# Altium schematic sheet Temperature_Controller_1.SchDoc
size A4; SheetNumber: 1; SheetTotal: 1
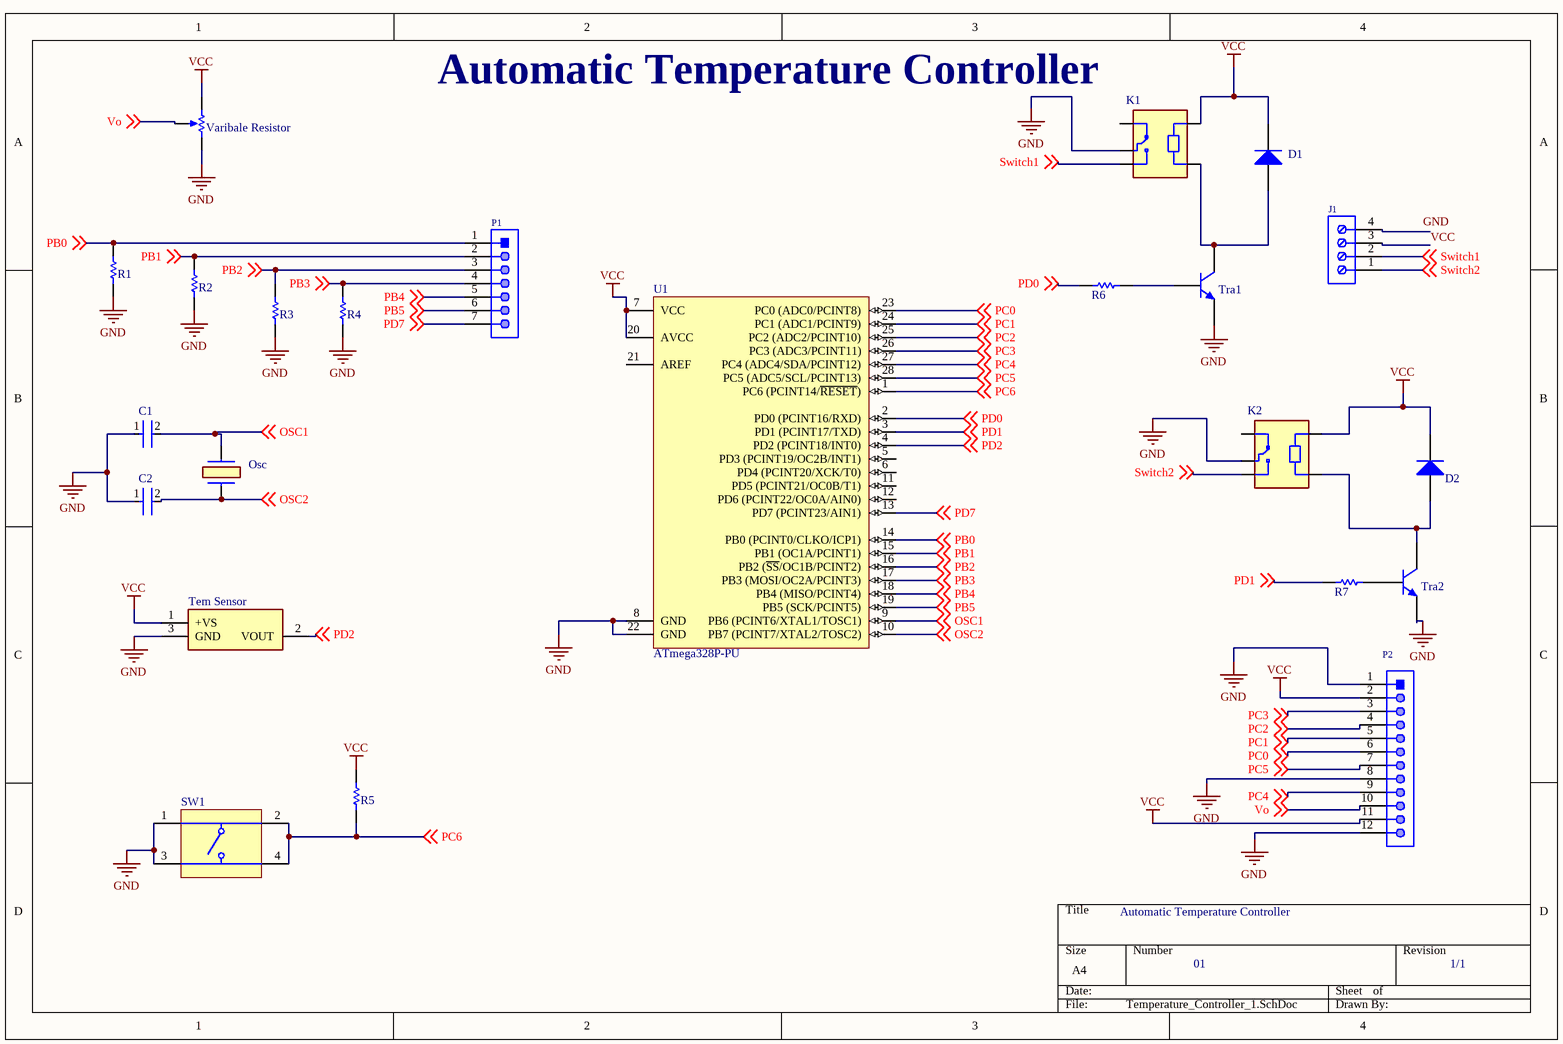
[diagram p0: Temperature_Controller_1.SchDoc]

## Parts
(Parts that share a designator on the sheet are numbered #1, #2 ... from top to bottom, then left to right.)
?#1  Tra1  [TO-226-AA]
?#2  J1  [691244510004]
C1  (no value)  [FP-RCE0K1-MFG]
C2  (no value)  [FP-RCE0K1-MFG]
D1  D1  [DO-41]
D2  D2  [DO-41]
K1  K1  [RELAY_SRD-05VDC-SL-C]
K2  K2  [RELAY_SRD-05VDC-SL-C]
Osc  (no value)  [ECS80204X]
P1  P1  [61300711121]
P3  P2  [61301211021]
R1  R1  [AXIAL-0.3]
R2  R2  [AXIAL-0.3]
R3  R3  [AXIAL-0.3]
R4  R4  [AXIAL-0.3]
R5  R5  [AXIAL-0.3]
R6  R6  [AXIAL-0.3]
R7  R7  [AXIAL-0.3]
SW1  SW1  [TECO-1825910-6_V]
Tem_Sensor  (no value)  [TL431CLP]
Tra2  Tra2  [TO-226-AA]
U1  ATmega328P-PU  [28P3]
Var_Resis?  Varibale Resistor  [VR5]

## Nets
GND: ?#1.3(E) C1.1 C2.1 K1.COM K2.COM P3.1 P3.8 P3.12 R1.1 R2.1 R3.1 R4.1 SW1.1 SW1.3 Tem_Sensor.3(GND) Tra2.3(E) U1.8(GND) U1.22(GND) Var_Resis?.2(BOT)
VCC: ?#2.3 D1.2(K) D2.2(K) K1.A2 K2.A2 P3.2 P3.11 R5.2 Tem_Sensor.1(+VS) U1.7(VCC) U1.20(AVCC) Var_Resis?.1(TOP)
OSC1: C1.2 Osc.2 U1.9(PB6_(PCINT6/XTAL1/TOSC1)) ; off-sheet OSC1
OSC2: C2.2 Osc.1 U1.10(PB7_(PCINT7/XTAL2/TOSC2)) ; off-sheet OSC2
PB0: P1.1 R1.2 U1.14(PB0_(PCINT0/CLKO/ICP1)) ; off-sheet PB0
PB1: P1.2 R2.2 U1.15(PB1_(OC1A/PCINT1)) ; off-sheet PB1
PB2: P1.3 R3.2 U1.16(PB2_(~{SS}/OC1B/PCINT2)) ; off-sheet PB2
PB3: P1.4 R4.2 U1.17(PB3_(MOSI/OC2A/PCINT3)) ; off-sheet PB3
PB4: P1.5 U1.18(PB4_(MISO/PCINT4)) ; off-sheet PB4
PB5: P1.6 U1.19(PB5_(SCK/PCINT5)) ; off-sheet PB5
PC0: P3.6 U1.23(PC0_(ADC0/PCINT8)) ; off-sheet PC0
PC1: P3.5 U1.24(PC1_(ADC1/PCINT9)) ; off-sheet PC1
PC2: P3.4 U1.25(PC2_(ADC2/PCINT10)) ; off-sheet PC2
PC3: P3.3 U1.26(PC3_(ADC3/PCINT11)) ; off-sheet PC3
PC4: P3.9 U1.27(PC4_(ADC4/SDA/PCINT12)) ; off-sheet PC4
PC5: P3.7 U1.28(PC5_(ADC5/SCL/PCINT13)) ; off-sheet PC5
PC6: R5.1 SW1.2 SW1.4 U1.1(PC6_(PCINT14/~{RESET})) ; off-sheet PC6
PD0: R6.2 U1.2(PD0_(PCINT16/RXD)) ; off-sheet PD0
PD1: R7.2 U1.3(PD1_(PCINT17/TXD)) ; off-sheet PD1
PD2: Tem_Sensor.2(VOUT) U1.4(PD2_(PCINT18/INT0)) ; off-sheet PD2
PD7: P1.7 U1.13(PD7_(PCINT23/AIN1)) ; off-sheet PD7
Switch1: ?#2.2 K1.NO ; off-sheet Switch1
Switch2: ?#2.1 K2.NO ; off-sheet Switch2
Vo: P3.10 Var_Resis?.3(TAP) ; off-sheet Vo
Net?#1_1: ?#1.1(C) D1.1(A) K1.A1
Net?#1_2: ?#1.2(B) R6.1
NetD2_1: D2.1(A) K2.A1 Tra2.1(C)
NetR7_1: R7.1 Tra2.2(B)

Not connected (* = marked no-connect by the designer): ?#2 4; K1 NC; K2 NC; U1 5(PD3_(PCINT19/OC2B/INT1)) 6(PD4_(PCINT20/XCK/T0)) 11(PD5_(PCINT21/OC0B/T1)) 12(PD6_(PCINT22/OC0A/AIN0)) 21(AREF)

## Notes on the sheet
- (near K1) Automatic Temperature Controller
- Automatic Temperature Controller
- 01
- 1/1
- Labels drawn without touching a wire or pin: GND

## Library data of the parts
?#1 Tra2 = NPN: NPN Bipolar Transistor; Published: 8-Jun-2000; LatestRevisionDate: 17-Jul-2002; LatestRevisionNote: Re-released for DXP Platform.; PackageReference: TO-226-AA; Publisher: Altium Limited; PackageDescription: TO, Flat Index; 3 In-Line, Axial Leads; Body Dia. 4.8mm; Leads 0.55 x 0.51 mm (max); Code_JEDEC: TO-226-AA
?#2 = CMP-1502-02650-1: Serie 2445 - 5.08 mm Horizontal Entry Modular with Rising Cage Clamp WR-TBL, 4 pin; Manufacturer: Wurth Elektronik; Pitch: 5.08mm; Pin Number: 4; Operating Temperature: -30to120degC; Publisher: WurthElektronik; Datasheet URL: http://katalog.we-online.de/em/datasheet/6912445100xx.pdf; Packaging: Box; Package Reference: 691244510004; Part Number: 691244510004; Mounting Technology: THT; Manufacturer URL: http://www.we-online.de
C1 C2 = CMP-06035-004895-1: Cap Ceramic 22pF 50V C0G ±5% Radial 5mm +125°C Automotive Bulk; Lead/Base Style: Formed Leads; Lead Diameter: 0.5mm; Max Operating Temperature: 125°C; Termination: Radial; Package Quantity: 2000; Capacitance: 22pF; Dielectric: C0G; Height - Seated (Max): 0.138inch; Width: 0.098inch; Lead Pitch: 0.197inch; Tolerance: 5%; Resistor Type: Ceramic; Case/Package: Radial; Mount: Through Hole; Voltage Rating: 50V; Ratings: AEC-Q200; Min Operating Temperature: -55°C; Packaging: Tape and Reel; Voltage Rating (DC): 50V; Height: 3.5mm; Length: 0.142inch
D1 D2 = Diode 1N4004: 1 Amp General Purpose Rectifier; Published: 8-Jun-2000; LatestRevisionDate: 17-Jul-2002; LatestRevisionNote: Re-released for DXP Platform.; DatasheetVersion: 1998; PackageVersion: Aug-1999; PackageReference: DO-41; Publisher: Altium Limited; PackageDescription: Diode, Axial; Body 5.2 x 2.7 mm (LxDia. max), Lead Dia. 0.86 mm (max); Code_JEDEC: DO-204-AL; ComponentLink1Description: Manufacturer Link; ComponentLink1URL: http://www.fairchildsemi.com/; ComponentLink2Description: Datasheet; ComponentLink2URL: http://www.fairchildsemi.com/ds/1N%2F1N4001.pdf
K1 K2 = SRD-05VDC-SL-C: 5V Trigger Relay Module For Arduino And Raspberry Pi 5V Trigger Relay Module For Arduino And Raspberry Pi; MF: Songle Relay; Check_prices: https://www.snapeda.com/parts/SRD-05VDC-SL-C/Songle+Relay/view-part/?ref=eda; Value: *; Availability: Not in stock; Price: None; Package: NON STANDARD-5 Songle Relay; MP: SRD-05VDC-SL-C; SnapEDA_Link: https://www.snapeda.com/parts/SRD-05VDC-SL-C/Songle+Relay/view-part/?ref=snap
Osc = ECS-80-20-4X: Crystals 8MHz 20pF; Manufacturer_Name: ECS; Geometry.Height: 3.5mm; Mouser Part Number: 520-HCU800-20X; Mouser Price/Stock: https://www.mouser.co.uk/ProductDetail/ECS/ECS-80-20-4X?qs=Plv2eWRe7VJH6hqFYPCsSw%3D%3D; Manufacturer_Part_Number: ECS-80-20-4X; Datasheet Link: https://componentsearchengine.com/Datasheets/1/ECS-80-20-4X.pdf
P1 = CMP-1502-01074-1: THT Vertical Pin Header WR-PHD, Pitch 2.54 mm, Single Row, 7 pins; Manufacturer: Wurth Elektronik; Pin Number: 7; Gender: Male; Working Voltage: 250VAC; Contact Resistance: 20mOhm; Rated Current: 3A; Pitch: 2.54mm; Withstanding Voltage: 500VAC; Row Number: Single; Packaging: Bag; Orientation: Vertical; Manufacturer URL: http://www.we-online.de; Datasheet URL: https://katalog.we-online.de/em/datasheet/6130xx11121.pdf; Part Number: 61300711121; Publisher: WurthElektronik; Operating Temperature: -40to105degC; Mounting Technology: THT; Package Reference: 61300711121
P3 = CMP-1502-01085-1: THT Angled Pin Header WR-PHD, Pitch 2.54 mm, Single Row, 12 pins; Manufacturer: Wurth Elektronik; Gender: Male; Withstanding Voltage: 500VAC; Working Voltage: 250VAC; Pitch: 2.54mm; Pin Number: 12; Rated Current: 3A; Contact Resistance: 20mOhm; Package Reference: 61301211021; Manufacturer URL: http://www.we-online.de; Orientation: Angled; Datasheet URL: https://katalog.we-online.de/em/datasheet/6130xx11021.pdf; Packaging: Bag; Operating Temperature: -40to105degC; Part Number: 61301211021; Publisher: WurthElektronik; Row Number: Single; Mounting Technology: THT
R1-R7 = Res1: Resistor; Published: 8-Jun-2000; LatestRevisionDate: 17-Jul-2002; LatestRevisionNote: Re-released for DXP Platform.; PackageReference: AXIAL-0.3; Publisher: Altium Limited; PackageDescription: Axial Device, Thru-Hole; 2 Leads; 0.3 in Pin Spacing
SW1 = CMP-1684-00021-1: Tact Switch, SPST-NO, 0.05 A, -35 to 85 degC, 4-Pin THD, RoHS, Bulk; Part No: 1825910-6; Manufacturer: TE Connectivity; Maximum Contact Resistance: 100mOhm; Mechanical Life: 100000Cycles; Bushing Type: Unthreaded; Switch Configuration: OFF(ON); Maximum DC Voltage Rating: 24V; Contact Rating @ Voltage: 0.05A@24VDC; Actuator Color: Black; Body Orientation: Straight; Function: MomentaryContact; Illumination: N/R; Actuator Style: RoundButton; Actuator Material: PolybutyleneTerephthalate; Dielectric Strength: 500VAC; Pole Throw Configuration: SPST; Actuator Length: 1.4mm; Product Weight: N/A; Contact Material: CopperAlloy; Housing Material: N/A; Terminal Type: PCPins; Minimum Insulation Resistance: 100MOhm; Package Description: 4-Pin Through Hole Device, Body 5.99 x 5.99 mm, Pitch 6.5 mm; Package Reference: THD; Base Material: N/A; Manufacturer URL: http://www.te.com; Contact Plating: Silver; RoHS: Yes; Datasheet Version: Rev. C9; Electrical Life: 100000Cycles; Maximum AC Voltage Rating: N/A; Thread Size: N/R; Operating Temperature: -35to85C; Mounting: ThroughHole; Dimension: 5.99x5mm; Datasheet URL: http://www.te.com/commerce/DocumentDelivery/DDEController?Action=showdoc&DocId=Customer+Drawing%7F1825910%7FC9%7Fpdf%7FEnglish%7FENG_CD_1825910_C9.pdf%7F1825910-6; Family: 1825910; Seal Location: N/A; Seal Description: N/A; Packaging: N/A
Tem_Sensor = LM35CZ_NOPB: +/-0.5C Temperature Sensor with Analog Output and 30V Capability; Manufacturer_Name: Texas Instruments; Manufacturer_Part_Number: LM35CZ/NOPB; Geometry.Height: 9.34mm; Mouser Part Number: 926-LM35CZ/NOPB; Mouser Price/Stock: https://www.mouser.co.uk/ProductDetail/Texas-Instruments/LM35CZ-NOPB?qs=QbsRYf82W3Fna65sQVTdFw%3D%3D; Datasheet Link: http://www.ti.com/lit/gpn/LM35
U1 = CMP-0095-00013-2: 8-bit AVR Microcontroller, 32KB Flash, 1KB EEPROM, 2KB SRAM, 28-pin PDIP, Industrial Grade (-40°C to 85°C); RevisionNote: DatasheetVersion updated. URLs added.; PackageVersion: revB, Sep-2001; PackageDescription: 28-lead (0.300"/7.62mm Wide) Plastic Dual Inline Package (PDIP); DatasheetVersion: revD, May-2011; ComponentLink1Description: Manufacturer URL; ComponentLink1URL: http://www.atmel.com/; PackageReference: 28P3; ComponentLink2Description: ATmega48A/48PA/88A/88PA/168A/168PA/328/328P Datasheet; ComponentLink3URL: http://www.atmel.com/dyn/resources/prod_documents/8271S.pdf; ComponentLink2URL: http://www.atmel.com/dyn/resources/prod_documents/8271.pdf; ComponentLink3Description: ATmega48A/48PA/88A/88PA/168A/168PA/328/328P Summary
Var_Resis? = RPot: Potentiometer; Sim Note: Enter the Resistance value and the set point into parameter fields.; Set Position: 0.5; Published: 8-Jun-2000; LatestRevisionDate: 17-Jul-2002; LatestRevisionNote: Re-released for DXP Platform.; PackageReference: VR5; Publisher: Altium Limited; PackageDescription: Variable Resistor, Thru-Hole; 3 Leads